# EAGLE schematic two_tone_#2 (EAGLE 6.6.0)
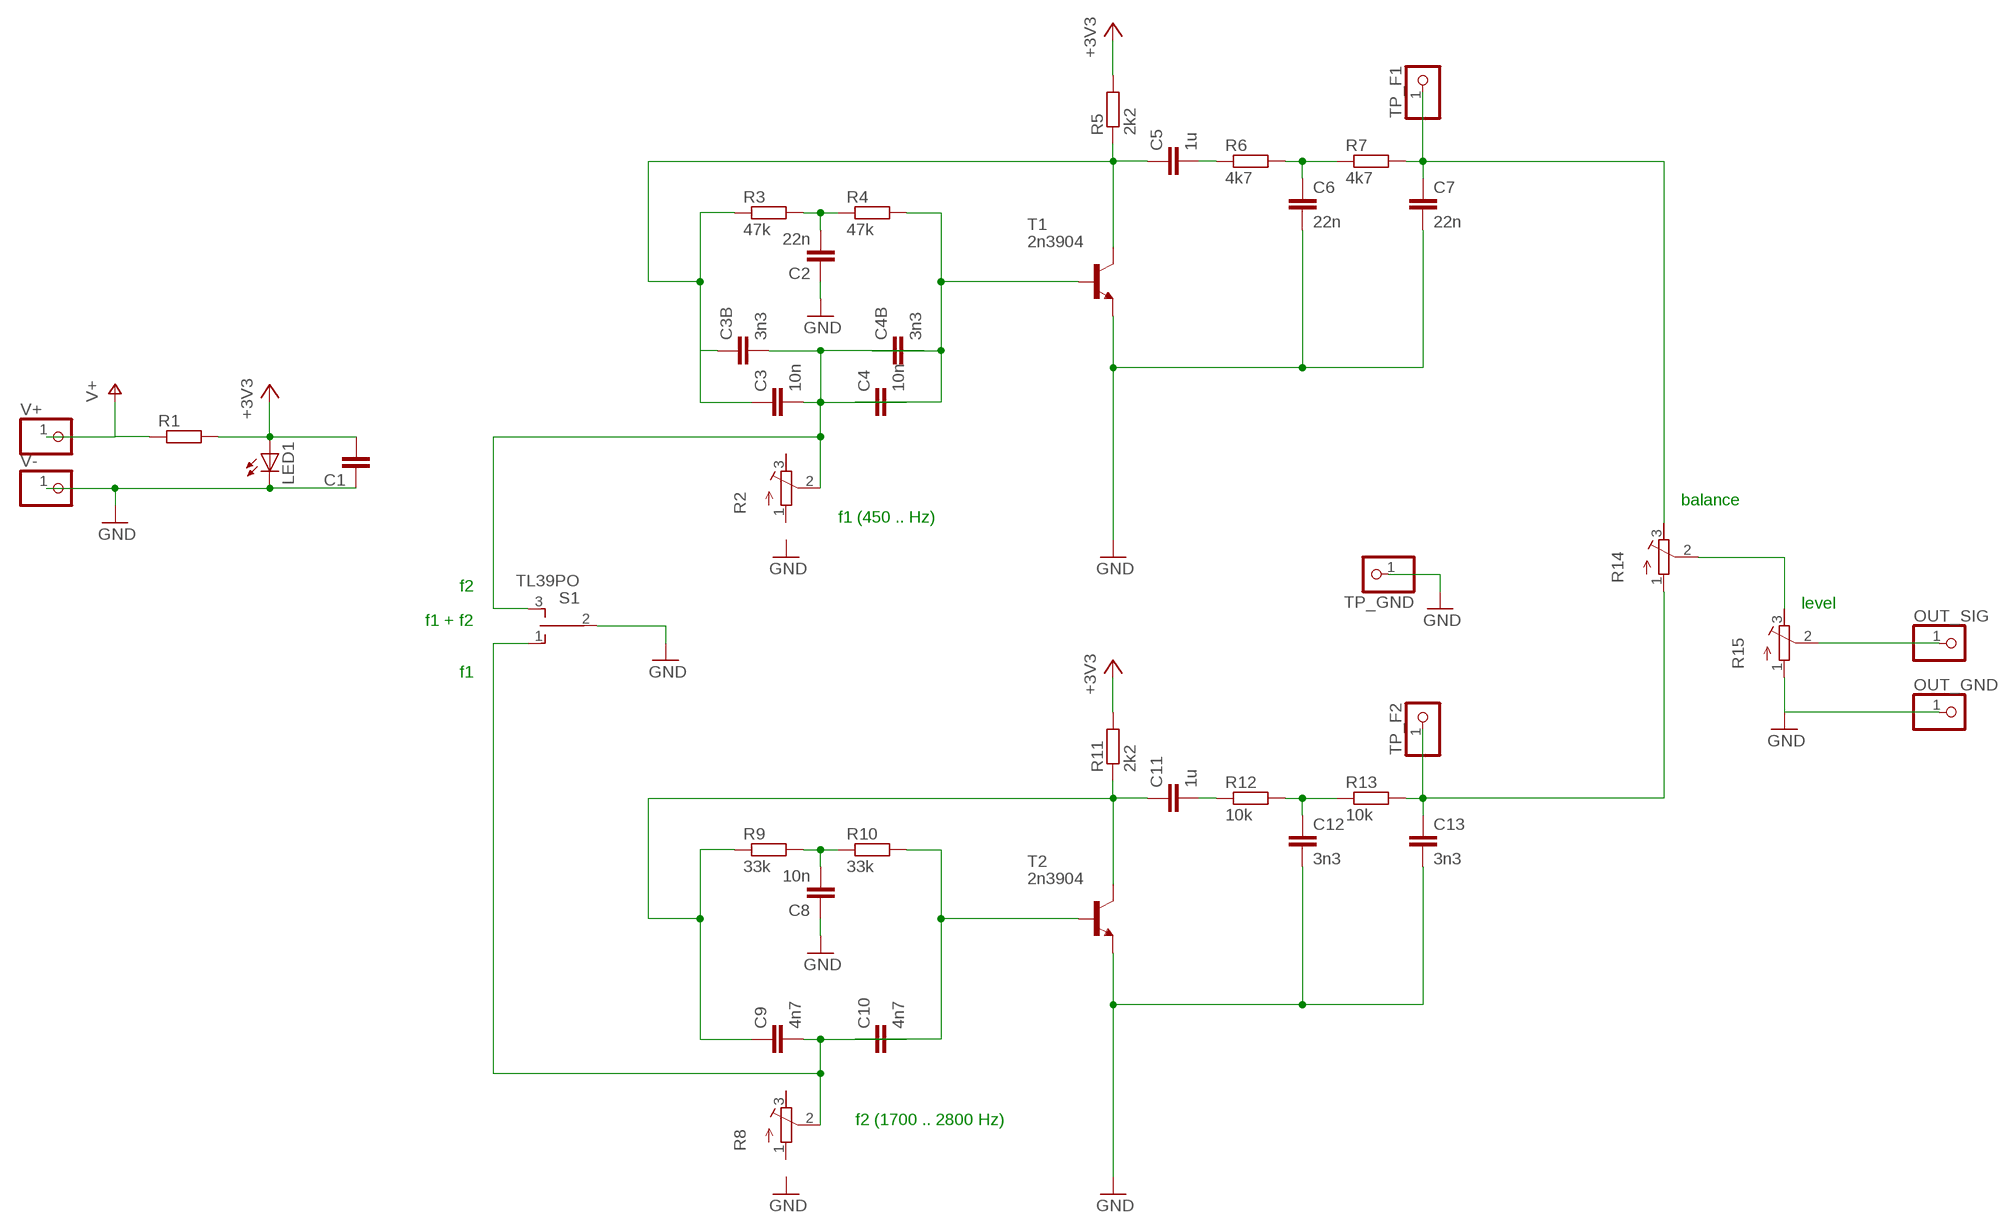
[diagram p0: schematic, sheet 1]

## Parts
C1  C-EU025_050-025X075  [C025_050-025X075]
C2  22n  C-EU025_050-025X075  [C025_050-025X075]
C3  10n  C-EU025_050-025X075  [C025_050-025X075]
C3B  3n3  C-EU025_050-025X075  [C025_050-025X075]
C4  10n  C-EU025_050-025X075  [C025_050-025X075]
C4B  3n3  C-EU025_050-025X075  [C025_050-025X075]
C5  1u  C-EU025_050-025X075  [C025_050-025X075]
C6  22n  C-EU025_050-025X075  [C025_050-025X075]
C7  22n  C-EU025_050-025X075  [C025_050-025X075]
C8  10n  C-EU025_050-025X075  [C025_050-025X075]
C9  4n7  C-EU025_050-025X075  [C025_050-025X075]
C10  4n7  C-EU025_050-025X075  [C025_050-025X075]
C11  1u  C-EU025_050-025X075  [C025_050-025X075]
C12  3n3  C-EU025_050-025X075  [C025_050-025X075]
C13  3n3  C-EU025_050-025X075  [C025_050-025X075]
LED1  LED3MM  [LED3MM]
OUT_GND  PINHD-1X1  [1X01]
OUT_SIG  PINHD-1X1  [1X01]
R1  R-EU_0207/2V  [0207/2V]
R2  R-TRIMM64W  [RTRIM64W]
R3  47k  R-EU_0207/10  [0207/10]
R4  47k  R-EU_0207/5V  [0207/5V]
R5  2k2  R-EU_0207/10  [0207/10]
R6  4k7  R-EU_0207/10  [0207/10]
R7  4k7  R-EU_0207/2V  [0207/2V]
R8  R-TRIMM64W  [RTRIM64W]
R9  33k  R-EU_0207/10  [0207/10]
R10  33k  R-EU_0207/5V  [0207/5V]
R11  2k2  R-EU_0207/10  [0207/10]
R12  10k  R-EU_0207/10  [0207/10]
R13  10k  R-EU_0207/2V  [0207/2V]
R14  R-TRIMM64W  [RTRIM64W]
R15  R-TRIMM64W  [RTRIM64W]
S1  TL39PO  [TL3XPO]
T1  2n3904  2N3904-NPN-TO92-EBC  [TO92-EBC]
T2  2n3904  2N3904-NPN-TO92-EBC  [TO92-EBC]
TP_F1  PINHD-1X1  [1X01]
TP_F2  PINHD-1X1  [1X01]
TP_GND  PINHD-1X1  [1X01]
V+  PINHD-1X1  [1X01]
V-  PINHD-1X1  [1X01]

## Nets
+3V3: C1.2 LED1.A R1.2 R5.2 R11.2
GND: C1.1 C2.1 C6.2 C7.2 C8.1 C12.2 C13.2 LED1.K(C) OUT_GND.1 R15.1(E) S1.2(P) T1.E T2.E TP_GND.1 V-.1
N$1: C5.2 R6.1
N$2: C6.1 R6.2 R7.1
N$3: C2.2 R3.2 R4.1
N$4: C4.1 C4B.1 R4.2 T1.B
N$5: C3.1 C3B.1 C5.1 R3.1 R5.1 T1.C
N$6: C3.2 C3B.2 C4.2 C4B.2 R2.2(S) S1.3(S)
N$7: C7.1 R7.2 R14.3(A) TP_F1.1
N$8: C8.2 R9.2 R10.1
N$9: C10.1 R10.2 T2.B
N$10: C9.1 C11.1 R9.1 R11.1 T2.C
N$11: C9.2 C10.2 R8.2(S) S1.1(O)
N$12: C11.2 R12.1
N$13: C12.1 R12.2 R13.1
N$14: C13.1 R13.2 R14.1(E) TP_F2.1
N$17: R14.2(S) R15.3(A)
N$18: OUT_SIG.1 R15.2(S)
V+: R1.1 V+.1
Unconnected: R2.1(E) R2.3(A) R8.1(E) R8.3(A)

## Notes on the sheet
- balance
- f1 (450 .. Hz)
- f2
- level
- f1 + f2
- f1
- f2 (1700 .. 2800 Hz)

## Library data of the parts
C1-C3 C3B C4 C4B C5-C13 = resistor:C-EU: CAPACITOR, European symbol
LED1 = led:LED: LED OSRAM: - CHIPLED LG R971, LG N971, LY N971, LG Q971, LY Q971, LO R971, LY R971 LH N974, LH R974 LS Q976, LO Q976, LY Q976 LO Q996 - Hyper CHIPLED LW Q18S LB Q993, LB Q99A, LB R99A - SideLED LS A670, LO A670, LY A670, LG A670, LP A670 LB A673, LV A673, LT A673, LW A673 LH A674 LY A675 LS A676, LA A676, LO A676, LY A676, LW A676 LS A679, LY A679, LG A679 - Hyper Micro SIDELED® LS Y876, LA Y876, LO Y876, LY Y876 LT Y87S - SmartLED LW L88C, LW L88S LB L89C, LB L89S, LG L890 LS L89K, LO L89K, LY L89K LS L896, LA L896, LO L896, LY L896 - TOPLED LS T670, LO T670, LY T670, LG T670, LP T670 LSG T670, LSP T670, LSY T670, LOP T670, LYG T670 LG T671, LOG T671, LSG T671 LB T673, LV T673, LT T673, LW T673 LH T674 LS T676, LA T676, LO T676, LY T676, LB T676, LH T676, LSB T676, LW T676 LB T67C, LV T67C, LT T67C, LS T67K, LO T67K, LY T67K, LW E67C LS E67B, LA E67B, LO E67B, LY E67B, LB E67C, LV E67C, LT E67C LW T67C LS T679, LY T679, LG T679 LS T770, LO T770, LY T770, LG T770, LP T770 LB T773, LV T773, LT T773, LW T773 LH T774 LS E675, LA E675, LY E675, LS T675 LS T776, LA T776, LO T776, LY T776, LB T776 LHGB T686 LT T68C, LB T68C - Hyper Mini TOPLED® LB M676 - Mini TOPLED Santana® LG M470 LS M47K, LO M47K, LY M47K Source: http://www.osram.convergy.de LUXEON: - LUMILED® LXK2-PW12-R00, LXK2-PW12-S00, LXK2-PW14-U00, LXK2-PW14-V00 LXK2-PM12-R00, LXK2-PM12-S00, LXK2-PM14-U00 LXK2-PE12-Q00, LXK2-PE12-R00, LXK2-PE12-S00, LXK2-PE14-T00, LXK2-PE14-U00 LXK2-PB12-K00, LXK2-PB12-L00, LXK2-PB12-M00, LXK2-PB14-N00, LXK2-PB14-P00, LXK2-PB14-Q00 LXK2-PR12-L00, LXK2-PR12-M00, LXK2-PR14-Q00, LXK2-PR14-R00 LXK2-PD12-Q00, LXK2-PD12-R00, LXK2-PD12-S00 LXK2-PH12-R00, LXK2-PH12-S00 LXK2-PL12-P00, LXK2-PL12-Q00, LXK2-PL12-R00 Source: www.luxeon.com KINGBRIGHT: KA-3528ASYC Source: www.kingbright.com
OUT_GND OUT_SIG TP_F1 TP_F2 TP_GND V+ V- = pinhead:PINHD-1X1: PIN HEADER
R1 R3-R7 R9-R13 = resistor:R-EU_: RESISTOR, European symbol
R2 R8 R14 R15 = resistor:R-TRIMM: Trimm resistor
S1 = switch:TL39PO: TINY SWITCH ON OFF ON Source: http://www2.produktinfo.conrad.com/datenblaetter/700000-724999/705152-da-01-de-Subminiaturschalter_TL_36YO.pdf
T1 T2 = transistor-neu-to92:*-NPN-: NPN Transistror